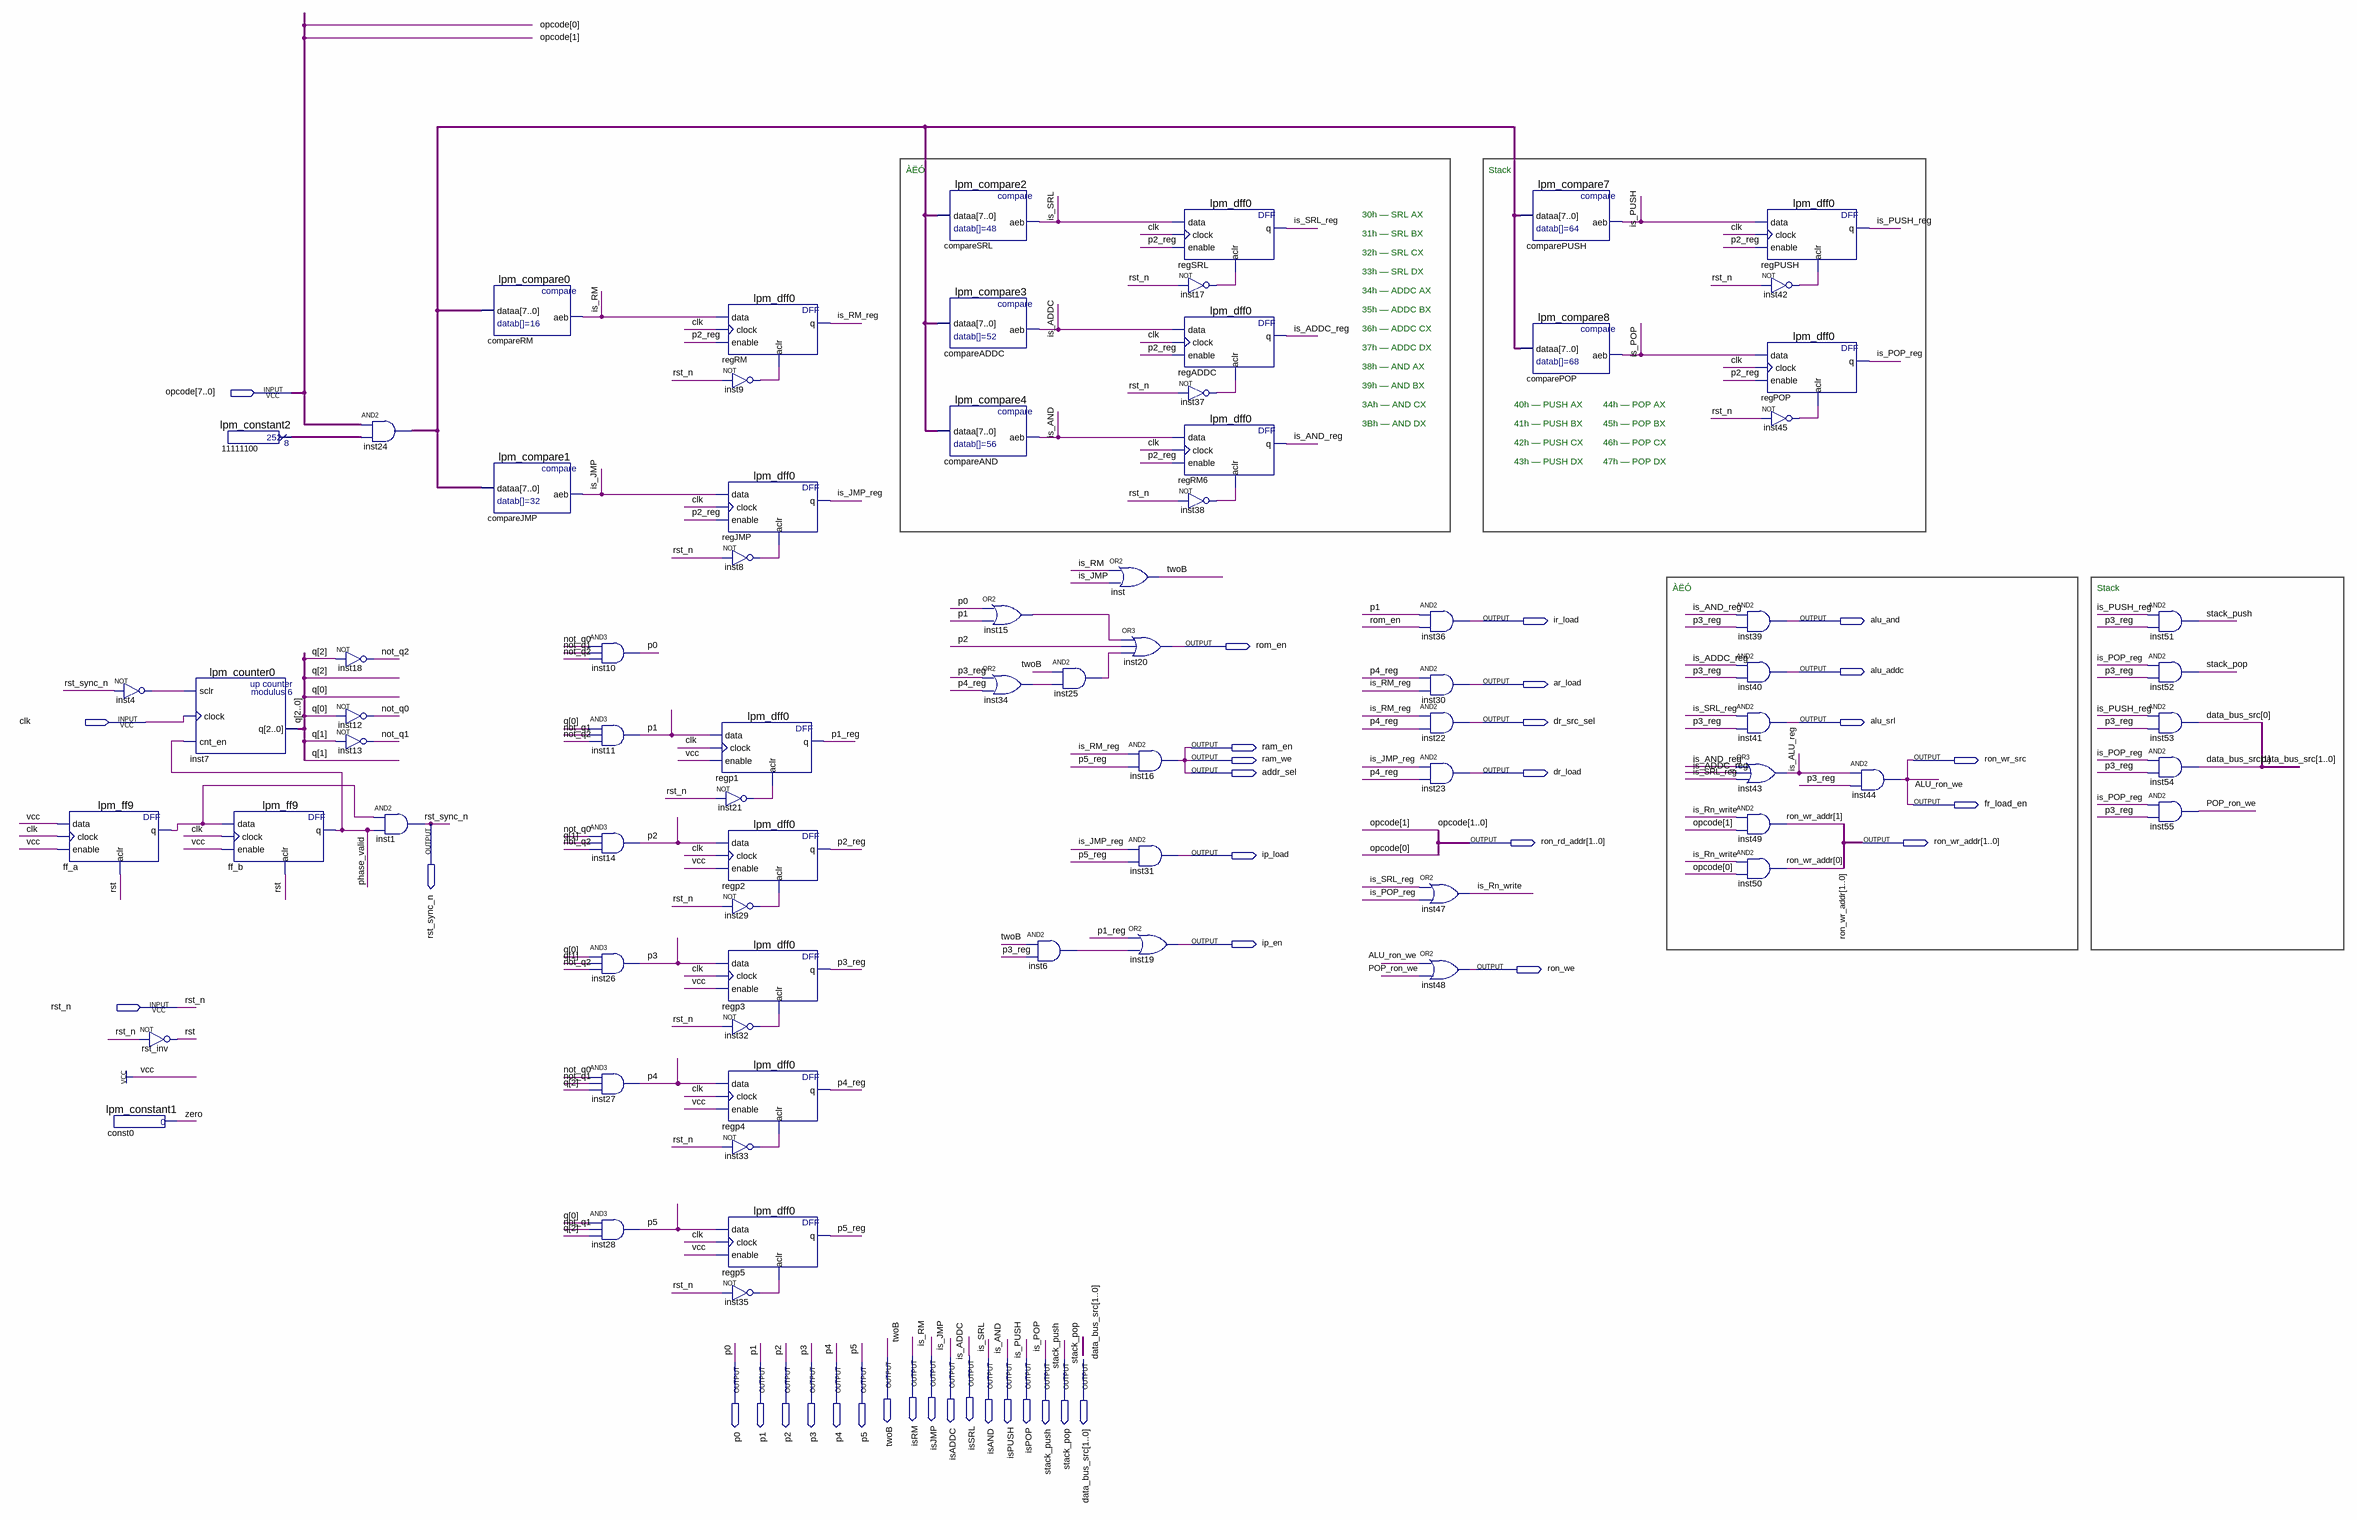
[diagram p0: schematic sheet]
// Quartus schematic control_unit.bdf as structural Verilog: 76 symbols, 39 pins
module control_unit (
  input  [7:0] opcode,
  input  clk,
  input  rst_n,
  output ir_load,
  output alu_and,
  output rom_en,
  output alu_addc,
  output ar_load,
  output dr_src_sel,
  output alu_srl,
  output ram_en,
  output ram_we,
  output ron_wr_src,
  output addr_sel,
  output dr_load,
  output fr_load_en,
  output rst_sync_n,
  output [1:0] ron_rd_addr,
  output [1:0] ron_wr_addr,
  output ip_load,
  output ip_en,
  output ron_we,
  output isRM,
  output isJMP,
  output isSRL,
  output twoB,
  output isADDC,
  output isAND,
  output isPUSH,
  output isPOP,
  output stack_push,
  output stack_pop,
  output [1:0] data_bus_src,
  output p0,
  output p1,
  output p2,
  output p3,
  output p4,
  output p5
);

  wire ff_a_q, inst4_out, inst6_out, inst8_out, inst9_out, inst15_out, inst17_out, inst21_out, inst25_out,
       inst29_out, inst32_out, inst33_out, inst34_out, inst35_out, inst37_out, inst38_out, inst42_out,
       inst45_out, is_ADDC_reg, is_ALU_reg, is_AND_reg, is_JMP_reg, is_POP_reg, is_PUSH_reg, is_RM_reg,
       is_Rn_write, is_SRL_reg, not_q0, not_q1, not_q2, p1_reg, p2_reg, p3_reg, p4_reg, p5_reg, phase_valid,
       POP_ron_we, rst, zero;
  wire [2:0] q;
  wire [7:0] inst24_out, n11111100_result;

  lpm_ff9 ff_a (.data(1'b1), .clock(clk), .enable(1'b1), .aclr(rst), .q(ff_a_q));
  lpm_constant1 const0 (.result(zero));
  not inst4 (inst4_out, rst_sync_n);
  not rst_inv (rst, rst_n);
  lpm_counter0 inst7 (.sclr(inst4_out), .clock(clk), .cnt_en(phase_valid), .q(q));
  lpm_constant2 u_11111100 (.result(n11111100_result));
  lpm_ff9 ff_b (.data(ff_a_q), .clock(clk), .enable(1'b1), .aclr(rst), .q(phase_valid));
  assign inst24_out = opcode & n11111100_result;  // AND2 inst24, 8 bits wide
  not inst18 (not_q2, q[2]);
  not inst12 (not_q0, q[0]);
  not inst13 (not_q1, q[1]);
  and inst1 (rst_sync_n, ff_a_q, phase_valid);
  lpm_compare0 compareRM (.dataa(inst24_out), .aeb(isRM));
  lpm_compare1 compareJMP (.dataa(inst24_out), .aeb(isJMP));
  and inst10 (p0, not_q0, not_q1, not_q2);
  and inst11 (p1, q[0], not_q1, not_q2);
  and inst14 (p2, not_q0, q[1], not_q2);
  and inst26 (p3, q[0], q[1], not_q2);
  and inst27 (p4, not_q0, not_q1, q[2]);
  and inst28 (p5, q[0], not_q1, q[2]);
  lpm_dff0 regRM (.data(isRM), .clock(clk), .enable(p2_reg), .aclr(inst9_out), .q(is_RM_reg));
  lpm_dff0 regJMP (.data(isJMP), .clock(clk), .enable(p2_reg), .aclr(inst8_out), .q(is_JMP_reg));
  lpm_dff0 regp1 (.data(p1), .clock(clk), .enable(1'b1), .aclr(inst21_out), .q(p1_reg));
  not inst21 (inst21_out, rst_n);
  lpm_dff0 regp2 (.data(p2), .clock(clk), .enable(1'b1), .aclr(inst29_out), .q(p2_reg));
  lpm_dff0 regp3 (.data(p3), .clock(clk), .enable(1'b1), .aclr(inst32_out), .q(p3_reg));
  lpm_dff0 regp4 (.data(p4), .clock(clk), .enable(1'b1), .aclr(inst33_out), .q(p4_reg));
  lpm_dff0 regp5 (.data(p5), .clock(clk), .enable(1'b1), .aclr(inst35_out), .q(p5_reg));
  not inst9 (inst9_out, rst_n);
  not inst8 (inst8_out, rst_n);
  not inst29 (inst29_out, rst_n);
  not inst32 (inst32_out, rst_n);
  not inst33 (inst33_out, rst_n);
  not inst35 (inst35_out, rst_n);
  lpm_compare2 compareSRL (.dataa(inst24_out), .aeb(isSRL));
  lpm_compare3 compareADDC (.dataa(inst24_out), .aeb(isADDC));
  lpm_compare4 compareAND (.dataa(inst24_out), .aeb(isAND));
  or inst15 (inst15_out, p0, p1);
  or inst34 (inst34_out, p3_reg, p4_reg);
  and inst25 (inst25_out, twoB, inst34_out);
  and inst6 (inst6_out, twoB, p3_reg);
  or inst (twoB, isRM, isJMP);
  or inst20 (rom_en, inst15_out, p2, inst25_out);
  lpm_dff0 regSRL (.data(isSRL), .clock(clk), .enable(p2_reg), .aclr(inst17_out), .q(is_SRL_reg));
  lpm_dff0 regADDC (.data(isADDC), .clock(clk), .enable(p2_reg), .aclr(inst37_out), .q(is_ADDC_reg));
  lpm_dff0 regRM6 (.data(isAND), .clock(clk), .enable(p2_reg), .aclr(inst38_out), .q(is_AND_reg));
  and inst16 (addr_sel, is_RM_reg, p5_reg);
  and inst31 (ip_load, is_JMP_reg, p5_reg);
  or inst19 (ip_en, p1_reg, inst6_out);
  not inst17 (inst17_out, rst_n);
  not inst37 (inst37_out, rst_n);
  not inst38 (inst38_out, rst_n);
  and inst36 (ir_load, p1, rom_en);
  and inst30 (ar_load, p4_reg, is_RM_reg);
  and inst22 (dr_src_sel, is_RM_reg, p4_reg);
  and inst23 (dr_load, is_JMP_reg, p4_reg);
  or inst47 (is_Rn_write, is_SRL_reg, is_POP_reg);
  or inst48 (ron_we, fr_load_en, POP_ron_we);
  lpm_compare7 comparePUSH (.dataa(inst24_out), .aeb(isPUSH));
  lpm_compare8 comparePOP (.dataa(inst24_out), .aeb(isPOP));
  lpm_dff0 regPUSH (.data(isPUSH), .clock(clk), .enable(p2_reg), .aclr(inst42_out), .q(is_PUSH_reg));
  not inst42 (inst42_out, rst_n);
  lpm_dff0 regPOP (.data(isPOP), .clock(clk), .enable(p2_reg), .aclr(inst45_out), .q(is_POP_reg));
  not inst45 (inst45_out, rst_n);
  and inst39 (alu_and, is_AND_reg, p3_reg);
  and inst40 (alu_addc, is_ADDC_reg, p3_reg);
  and inst41 (alu_srl, is_SRL_reg, p3_reg);
  or inst43 (is_ALU_reg, is_AND_reg, is_ADDC_reg, is_SRL_reg);
  and inst49 (ron_wr_addr[1], is_Rn_write, opcode[1]);
  and inst50 (ron_wr_addr[0], is_Rn_write, opcode[0]);
  and inst44 (fr_load_en, is_ALU_reg, p3_reg);
  and inst51 (stack_push, is_PUSH_reg, p3_reg);
  and inst52 (stack_pop, is_POP_reg, p3_reg);
  and inst53 (data_bus_src[0], is_PUSH_reg, p3_reg);
  and inst54 (data_bus_src[1], is_POP_reg, p3_reg);
  and inst55 (POP_ron_we, is_POP_reg, p3_reg);

  assign ram_en = addr_sel;
  assign ram_we = addr_sel;
  assign ron_rd_addr = opcode[1:0];
  assign ron_wr_src = fr_load_en;

  // Other names for the same wires on the sheet: ALU_ron_we = fr_load_en; is_ADDC = isADDC; is_AND = isAND;
  //   is_JMP = isJMP; is_POP = isPOP; is_PUSH = isPUSH; is_RM = isRM; is_SRL = isSRL

  // Notes on the sheet:
  //   ÀËÓ
  //   Stack
  //   30h — SRL AX
  //   31h — SRL BX
  //   32h — SRL CX
  //   33h — SRL DX
  //   34h — ADDC AX
  //   35h — ADDC BX
  //   36h — ADDC CX
  //   37h — ADDC DX
  //   38h — AND AX
  //   39h — AND BX
  //   3Ah — AND CX
  //   40h — PUSH AX
  //   44h — POP AX
  //   3Bh — AND DX
  //   41h — PUSH BX
  //   45h — POP BX
  //   42h — PUSH CX
  //   46h — POP CX
  //   43h — PUSH DX
  //   47h — POP DX
  //   ÀËÓ
  //   Stack
endmodule
